# EAGLE design BoB Brain v01 (EAGLE 7.3.0)
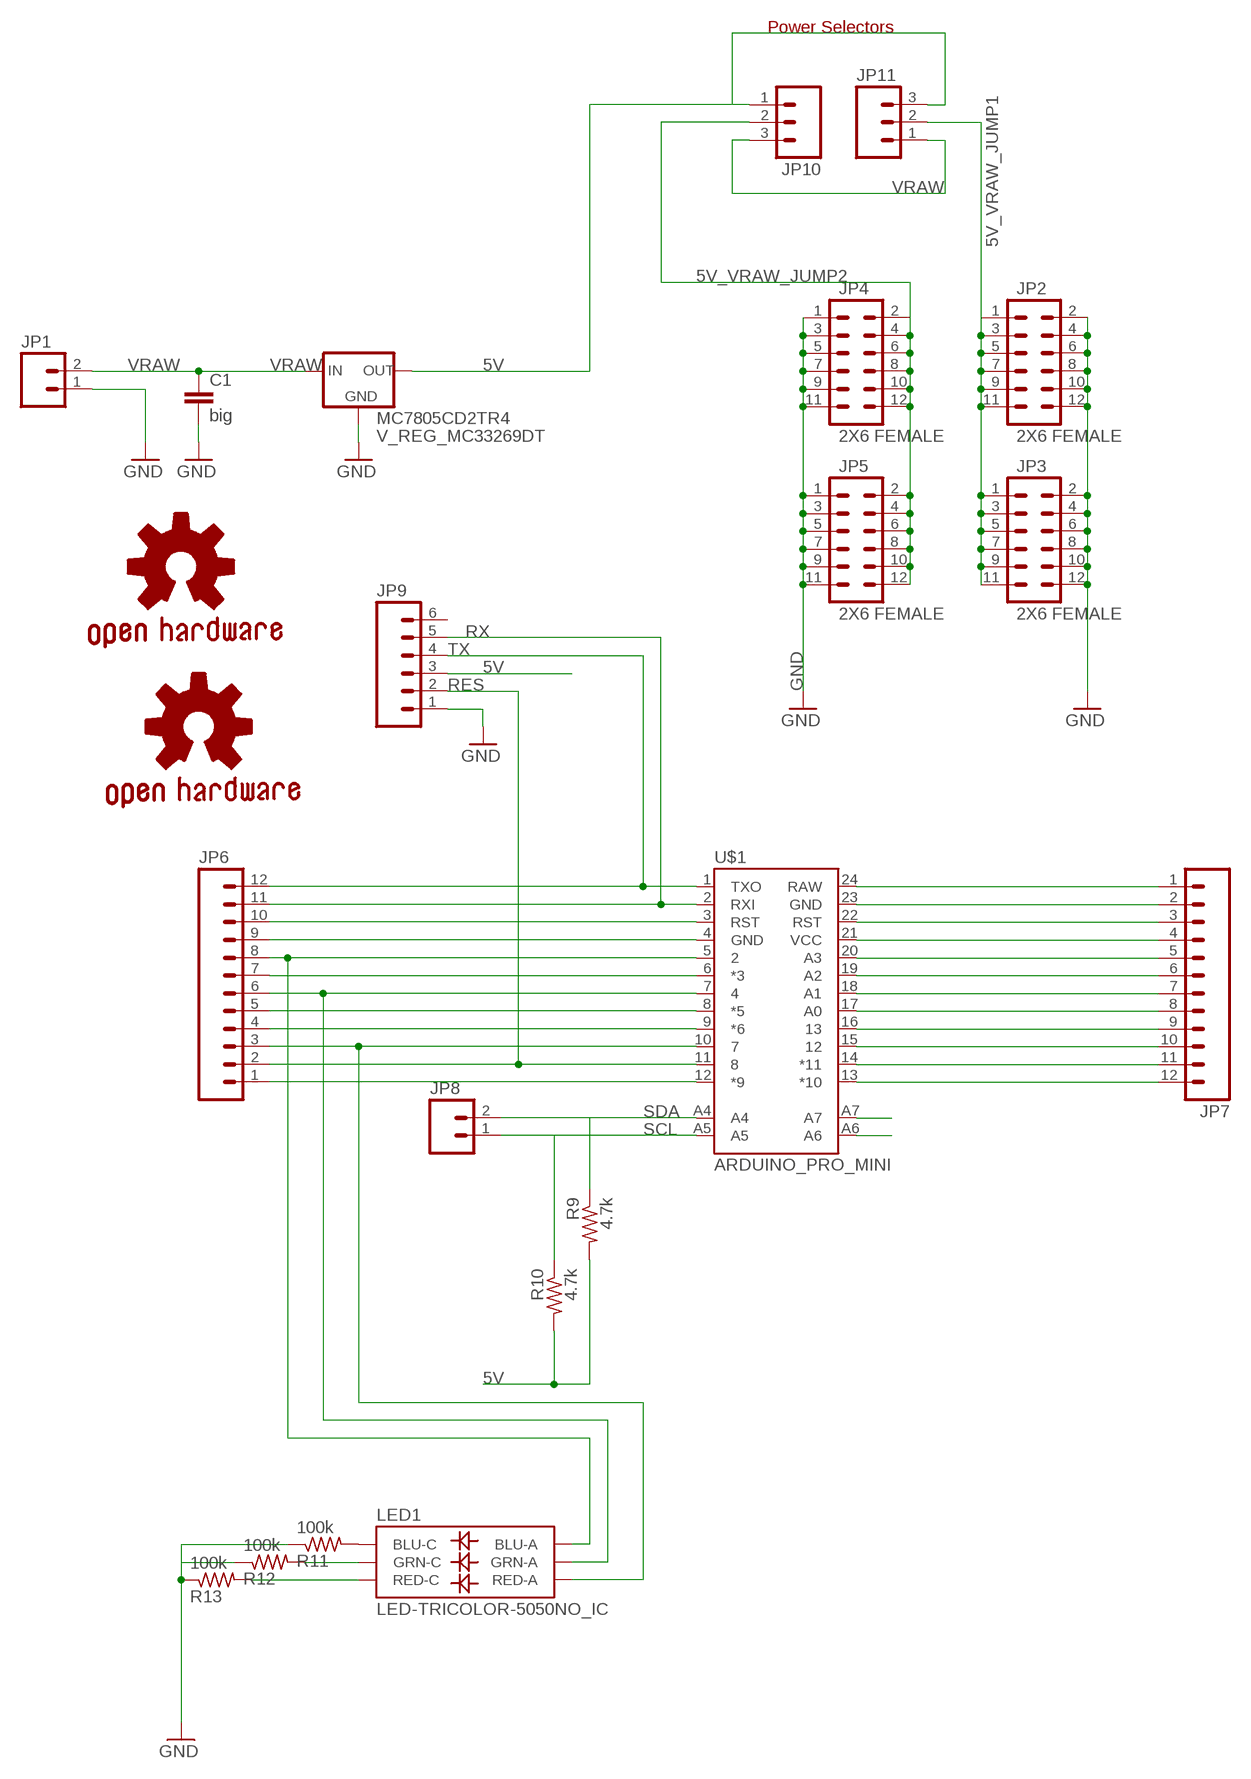
[diagram p0: schematic, sheet 1]

## Parts
C1  big  CAPPTH1  [CAP-PTH-5MM]
GOLD_ORB_SM1  OSHWLOGO_GOLD_ORB_MED  [OSHW1]
GOLD_ORB_SM2  OSHWLOGO_GOLD_ORB_SM  [OSHW2]
JP1  M025MM  [SCREWTERMINAL-5MM-2]
JP2  2X6 FEMALE  M06X2PTH_FEMALE  [2X6]
JP3  2X6 FEMALE  M06X2PTH_FEMALE  [2X6]
JP4  2X6 FEMALE  M06X2PTH_FEMALE  [2X6]
JP5  2X6 FEMALE  M06X2PTH_FEMALE  [2X6]
JP6  M12PTH  [1X12]
JP7  M12PTH  [1X12]
JP8  M02LOCK  [1X02_LOCK]
JP9  M06LOCK  [1X06_LOCK]
JP10  M03PTH  [1X03]
JP11  M03PTH  [1X03]
LED1  LED-TRICOLOR-5050NO_IC  [LED-TRICOLOR-5050]
MC7805CD2TR4  V_REG_MC33269DT  [DPAK]
R9  4.7k  R-US_M0805  [M0805]
R10  4.7k  R-US_M0805  [M0805]
R11  100k  R-US_R0805W  [R0805W]
R12  100k  R-US_R0805W  [R0805W]
R13  100k  R-US_R0805W  [R0805W]
U$1  ARDUINO_PRO_MINI  [ARDUINO_PRO_MINI]

## Nets
5V: JP9.3 JP10.1 JP11.3 MC7805CD2TR4.4(OUT) R9.2 R10.2
5V_VRAW_JUMP1: JP2.1 JP2.3 JP2.5 JP2.7 JP2.9 JP2.11 JP3.1 JP3.3 JP3.5 JP3.7 JP3.9 JP3.11 JP11.2
5V_VRAW_JUMP2: JP4.2 JP4.4 JP4.6 JP4.8 JP4.10 JP4.12 JP5.2 JP5.4 JP5.6 JP5.8 JP5.10 JP5.12 JP10.2
APM_PIN_3: JP6.7 U$1.6(*3)
APM_PIN_5: JP6.5 U$1.8(*5)
APM_PIN_6: JP6.4 U$1.9(*6)
APM_PIN_9: JP6.1 U$1.12(*9)
GND: C1.2 JP1.1 JP2.2 JP2.4 JP2.6 JP2.8 JP2.10 JP2.12 JP3.2 JP3.4 JP3.6 JP3.8 JP3.10 JP3.12 JP4.1 JP4.3 JP4.5 JP4.7 JP4.9 JP4.11 JP5.1 JP5.3 JP5.5 JP5.7 JP5.9 JP5.11 JP9.1 MC7805CD2TR4.1(GND) R11.1 R12.1 R13.1
N$3: JP6.10 U$1.3(RST)
N$4: JP6.9 U$1.4(GND)
N$5: JP6.8 LED1.3(BLU-A) U$1.5
N$6: LED1.4(BLU-C) R11.2
N$7: JP6.6 LED1.1(GRN-A) U$1.7
N$8: LED1.6(GRN-C) R12.2
N$9: LED1.5(RED-C) R13.2
N$10: JP6.3 LED1.2(RED-A) U$1.10
N$15: JP7.1 U$1.24(RAW)
N$16: JP7.2 U$1.23(GND)
N$17: JP7.3 U$1.22(RST)
N$18: JP7.4 U$1.21(VCC)
N$19: JP7.5 U$1.20(A3)
N$20: JP7.6 U$1.19(A2)
N$21: JP7.7 U$1.18(A1)
N$22: JP7.8 U$1.17(A0)
N$23: JP7.9 U$1.16
N$24: JP7.10 U$1.15
N$25: JP7.11 U$1.14(*11)
N$26: JP7.12 U$1.13(*10)
N$27: U$1.A7
N$28: U$1.A6
RES: JP6.2 JP9.2 U$1.11
RX: JP6.11 JP9.5 U$1.2(RXI)
SCL: JP8.1 R10.1 U$1.A5
SDA: JP8.2 R9.1 U$1.A4
TX: JP6.12 JP9.4 U$1.1(TXO)
VRAW: C1.1 JP1.2 JP10.3 JP11.1 MC7805CD2TR4.3(IN)
Unconnected: JP9.6

## Notes on the sheet
- Power Selectors

## Library data of the parts
C1 = SparkFun-Passives:CAP: Capacitor Standard 0603 ceramic capacitor, and 0.1" leaded capacitor.
GOLD_ORB_SM1 GOLD_ORB_SM2 = bfl:OSHWLOGO: These are Open-Source Hardware logos.
JP1 = SparkFun-Connectors:M02: Standard 2-pin 0.1" header. Use with - straight break away headers ( PRT-00116) - right angle break away headers (PRT-00553) - swiss pins (PRT-00743) - machine pins (PRT-00117) - female headers (PRT-00115) Molex polarized connector foot print use with: PRT-08233 with associated crimp pins and housings. 2.54_SCREWTERM for use with PRT-10571. 3.5mm Screw Terminal footprints for PRT-08084 5mm Screw Terminal footprints for use with PRT-08432; STOREFRONT_ID: PRT-08432
JP2-JP5 = SparkFun-Connectors:M06X2; PROD_ID: CONN-12423
JP6 JP7 = SparkFun-Connectors:M12: Header 12 Standard 12-pin 0.1" header. Use with straight break away headers (SKU : PRT-00116), right angle break away headers (PRT-00553), swiss pins (PRT-00743), machine pins (PRT-00117), and female headers (PRT-00115).
JP8 = SparkFun-Connectors:M02: Standard 2-pin 0.1" header. Use with - straight break away headers ( PRT-00116) - right angle break away headers (PRT-00553) - swiss pins (PRT-00743) - machine pins (PRT-00117) - female headers (PRT-00115) Molex polarized connector foot print use with: PRT-08233 with associated crimp pins and housings. 2.54_SCREWTERM for use with PRT-10571. 3.5mm Screw Terminal footprints for PRT-08084 5mm Screw Terminal footprints for use with PRT-08432
JP9 = SparkFun-Connectors:M06: Header 6 Standard 6-pin 0.1" header. Use with straight break away headers (SKU : PRT-00116), right angle break away headers (PRT-00553), swiss pins (PRT-00743), machine pins (PRT-00117), and female headers (PRT-00115). Molex polarized connector foot print use with SKU : PRT-08094 with associated crimp pins and housings. NOTES ON THE VARIANTS LOCK and LOCK_LONGPADS... This footprint was designed to help hold the alignment of a through-hole component (i.e. 6-pin header) while soldering it into place. You may notice that each hole has been shifted either up or down by 0.005 of an inch from it's more standard position (which is a perfectly straight line). This slight alteration caused the pins (the squares in the middle) to touch the edges of the holes. Because they are alternating, it causes a "brace" to hold the component in place. 0.005 has proven to be the perfect amount of "off-center" position when using our standard breakaway headers. Although looks a little odd when you look at the bare footprint, once you have a header in there, the alteration is very hard to notice. Also,if you push a header all the way into place, it is covered up entirely on the bottom side. This idea of altering the position of holes to aid alignment will be further integrated into the Sparkfun Library for other footprints. It can help hold any component with 3 or more connection pins.
JP10 JP11 = SparkFun-Connectors:M03: Header 3 Standard 3-pin 0.1" header. Use with straight break away headers (SKU : PRT-00116), right angle break away headers (PRT-00553), swiss pins (PRT-00743), machine pins (PRT-00117), and female headers (PRT-00115). Molex polarized connector foot print use with SKU : PRT-08232 with associated crimp pins and housings.
LED1 = SparkFun-LED:LED-TRICOLOR-5050
MC7805CD2TR4 = SparkFun-PowerIC:V_REG_MC33269
R9-R13 = resistor:R-US_: RESISTOR, American symbol
U$1 = SparkFun-Boards:ARDUINO_PRO_MINI

## Board
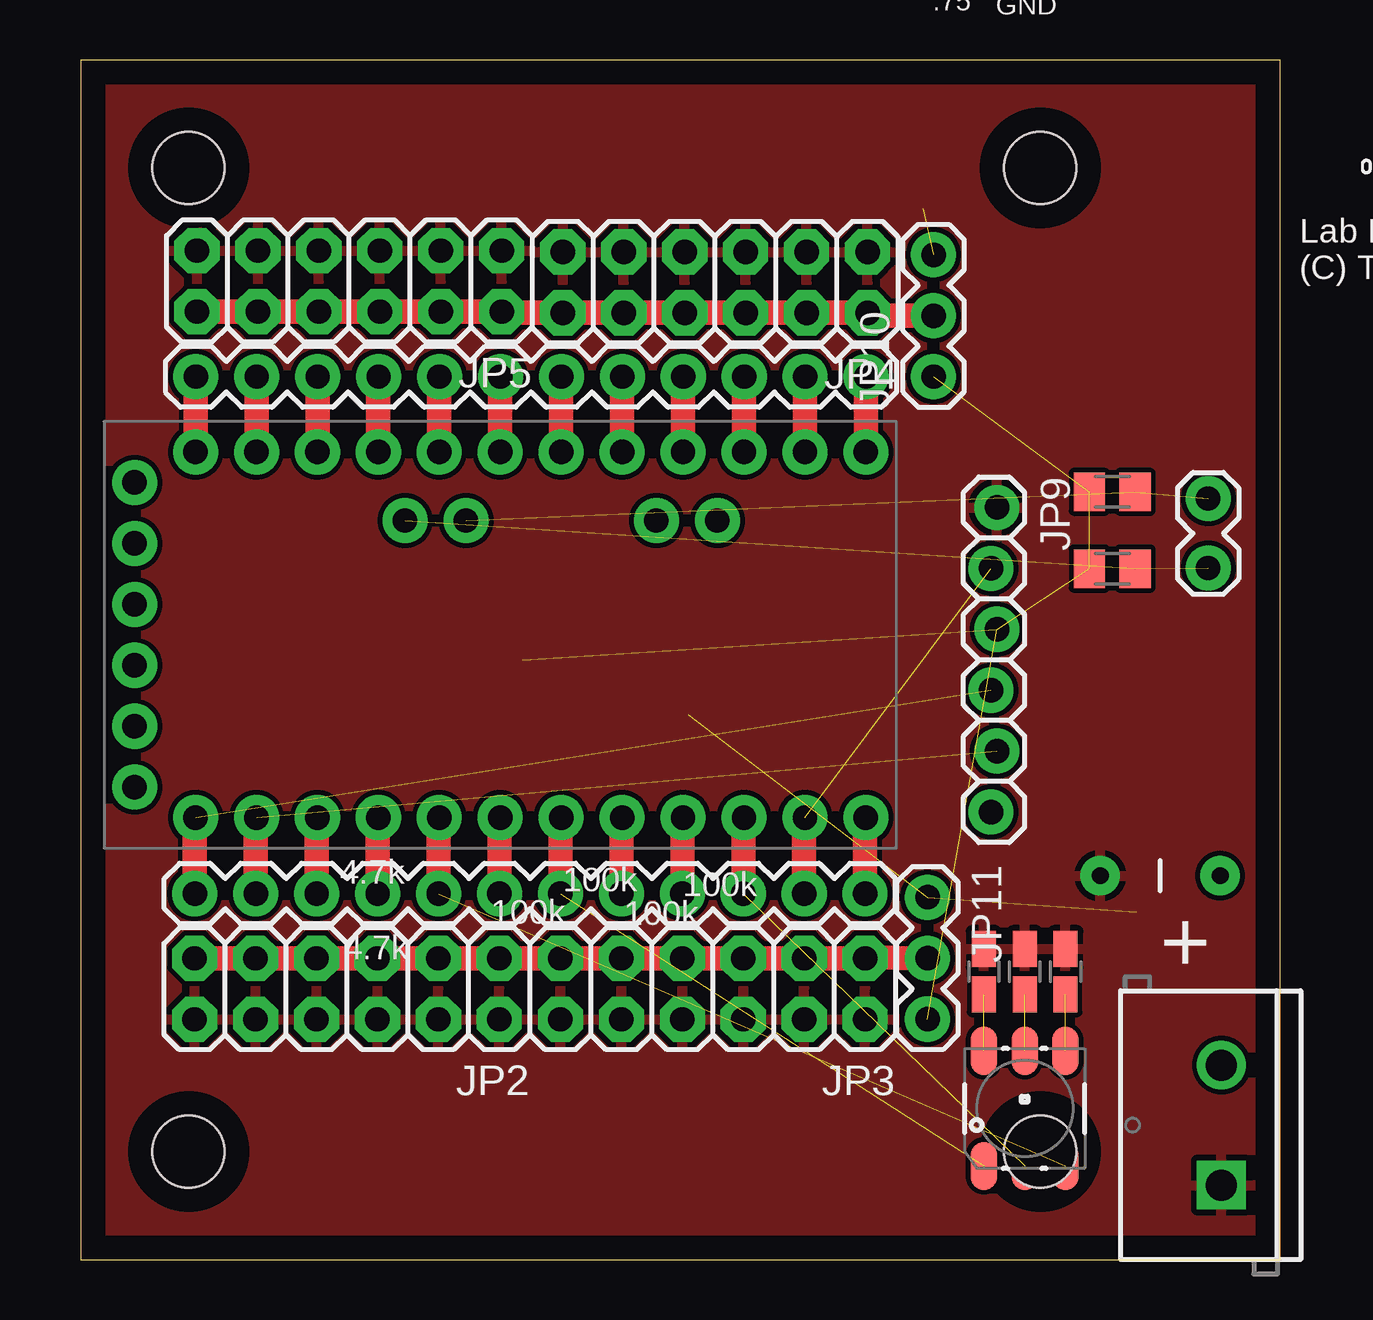
[diagram p1: board, top side]
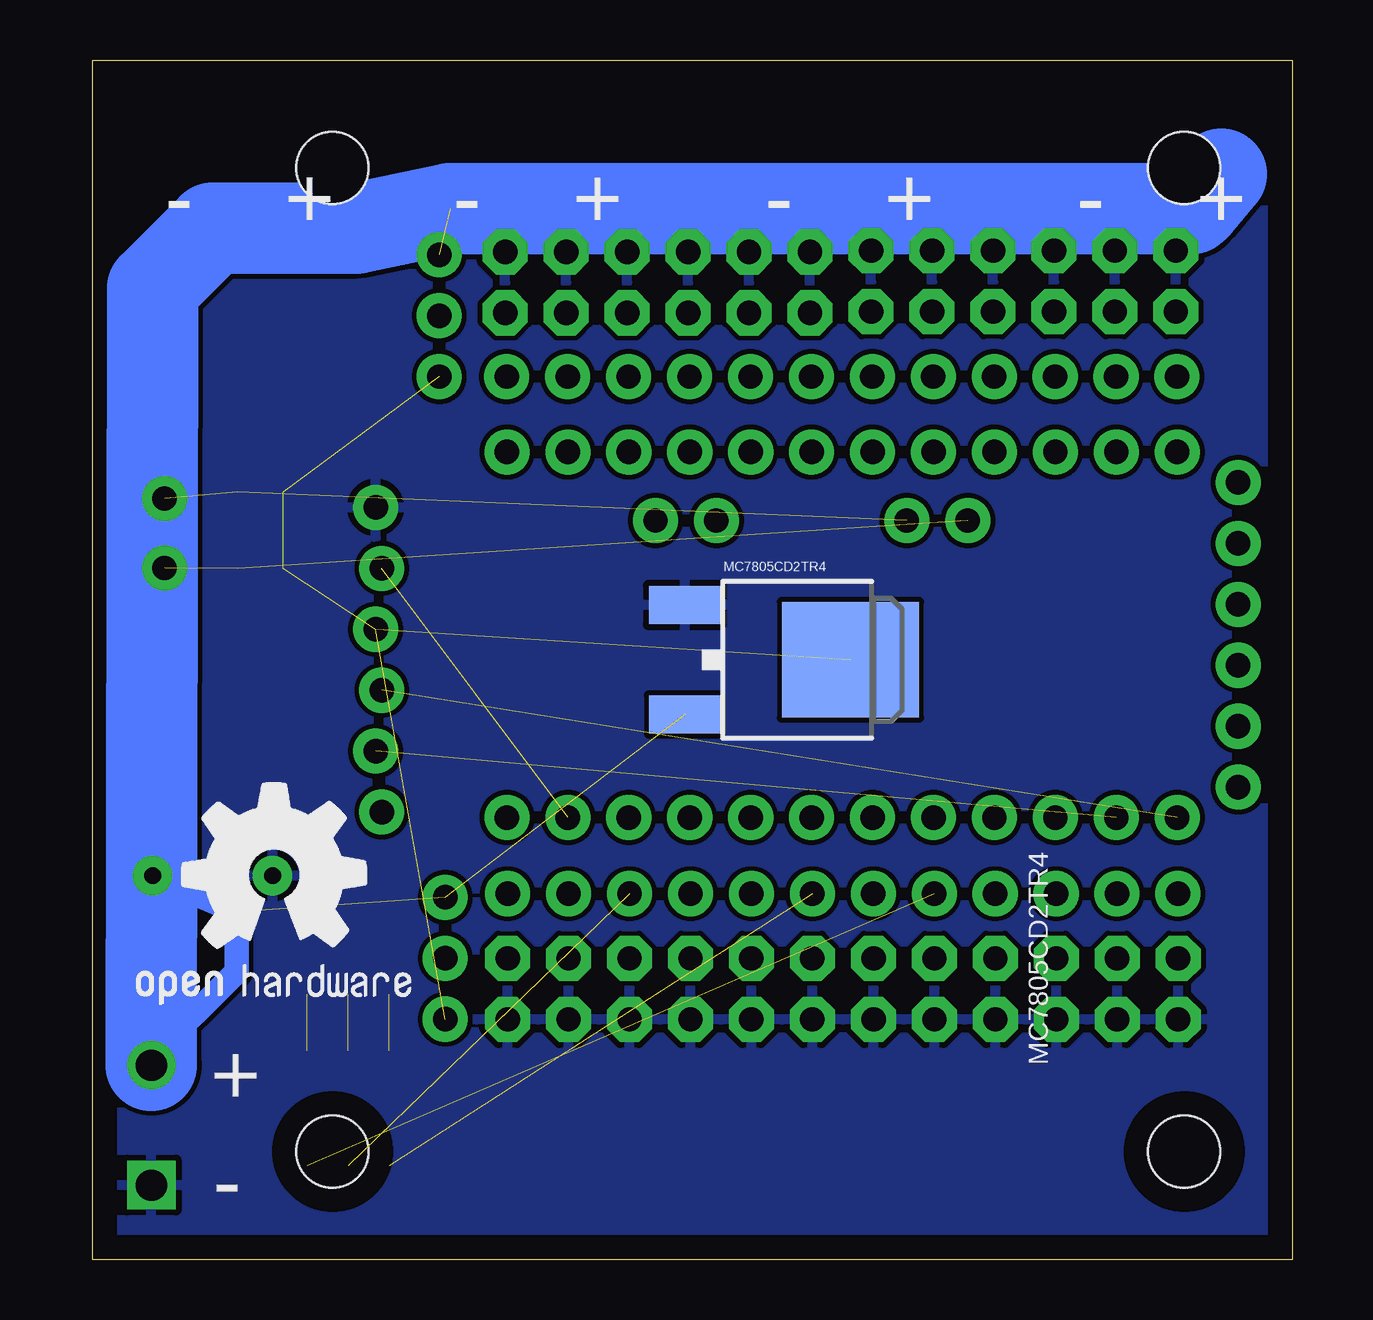
[diagram p2: board, bottom side, seen from below]

Size 50 x 50 mm. Coordinates in mm from the lower left corner, seen from the top.
Outline: 0,0 50,0 50,50 0,50 0,0
Copper layers (1*16): Top 0.035mm / dielectric 1.5mm / Bottom 0.035mm
Design rules "default": minimum track width 10mil, minimum drill 24mil, track to track 8mil, track to pad 8mil, pad to pad 8mil, via to via 8mil, smd to smd 8mil, copper to edge 40mil, drill to drill 8mil, minimum pad ring 10mil, minimum via ring 8mil, stop-mask expansion 4mil, vias tented up to drill 0mil, thermal gap 10mil
Holes 3 mm at 4.5,45.5 40,45.5 4.5,4.5 40,4.5

### Footprints (pad centres in the part's own frame; a part is rotated, then mirrored left to right if it is on the bottom)
CAP-PTH-5MM = drill 0.7 pad 1.651: 1 -2.5,0; 2 2.5,0
SCREWTERMINAL-5MM-2 = drill 1.3 pad 2.032 square: 1 0,0 | drill 1.3 pad 2.032: 2 5,0
2X6 = drill 1.016 pad 1.88 octagon: 1 0,0; 2 0,2.54; 3 2.54,0; 4 2.54,2.54; 5 5.08,0; 6 5.08,2.54; 7 7.62,0; 8 7.62,2.54; 9 10.16,0; 10 10.16,2.54; 11 12.7,0; 12 12.7,2.54
1X12 = drill 1.016 pad 1.88: 1 0,0; 2 2.54,0; 3 5.08,0; 4 7.62,0; 5 10.16,0; 6 12.7,0; 7 15.24,0; 8 17.78,0; 9 20.32,0; 10 22.86,0; 11 25.4,0; 12 27.94,0
1X02_LOCK = drill 1.016 pad 1.88: 1 -0.178,0; 2 2.718,0
1X06_LOCK = drill 1.016 pad 1.88: 1 0,0; 2 2.54,-0.254; 3 5.08,0; 4 7.62,-0.254; 5 10.16,0; 6 12.7,-0.254
1X03 = drill 1.016 pad 1.88: 1 0,0; 2 2.54,0; 3 5.08,0
LED-TRICOLOR-5050 = smd 2 x 1.1: 1 -2.4,1.7; 2 -2.4,0; 3 -2.4,-1.7; 4 2.4,-1.7; 5 2.4,0; 6 2.4,1.7
DPAK = smd 1.6 x 3: 1 -2.28,-5.31; 3 2.28,-5.31 | smd 4.826 x 5.715: 4 0,1.588
M0805 = smd 1.3 x 1.6: 1 -0.95,0; 2 0.95,0
R0805W = smd 1.5 x 1: 1 -0.94,0; 2 0.94,0
ARDUINO_PRO_MINI = drill 1.016 pad 1.88: 1 -7.62,12.7; 2 -7.62,10.16; 3 -7.62,7.62; 4 -7.62,5.08; 5 -7.62,2.54; 6 -7.62,0; 7 -7.62,-2.54; 8 -7.62,-5.08; 9 -7.62,-7.62; 10 -7.62,-10.16; 11 -7.62,-12.7; 12 -7.62,-15.24; 13 7.62,-15.24; 14 7.62,-12.7; 15 7.62,-10.16; 16 7.62,-7.62; 17 7.62,-5.08; 18 7.62,-2.54; 19 7.62,0; 20 7.62,2.54; 21 7.62,5.08; 22 7.62,7.62; 23 7.62,10.16; 24 7.62,12.7; A4 4.763,1.429; A5 4.763,3.969; A6 4.763,-9.049; A7 4.763,-6.509; BLK -6.35,15.24; GND -3.81,15.24; GRN 6.35,15.24; RXI 1.27,15.24; TXO 3.81,15.24; VCC -1.27,15.24

### Placement (x,y rotation side)
C1  45,16 180 top
GOLD_ORB_SM1  48.8,8.9 0 bottom
GOLD_ORB_SM2  53,44 0 top
JP1  47.55,3.1 90 top
JP2  17.45,12.55 180 top
JP3  32.7,12.55 180 top
JP4  32.8,42 180 top
JP5  17.55,42.05 180 top
JP6  32.7,15.25 180 top
JP7  4.8,36.8 0 top
JP8  47,29 90 top
JP9  38.2,31.35 270 top
JP10  35.55,36.8 90 top
JP11  35.3,15.1 270 top
LED1  39.35,6.3 90 top
MC7805CD2TR4  20,25 270 bottom
R9  43,32 180 top
R10  43,28.8 180 top
R11  41.05,12 270 top
R12  37.65,12 270 top
R13  39.35,12 270 top
U$1  17.49,26.04 90 top

### Tracks (layer width: path | path; a pad name or v marks a point on that pad's centre or on a via)
5V  (5 unrouted)
5V_VRAW_JUMP1
  Top 1.016: JP11.2 32.7,12.59 JP3.1 JP3.3 JP3.5 JP3.7 JP3.9 JP3.11 JP2.1 JP2.3 JP2.5 JP2.7 JP2.9 JP2.11
5V_VRAW_JUMP2
  Top 1.016: JP10.2 32.8,39.34 JP4.2 JP4.4 JP4.6 JP4.8 JP4.10 JP4.12 17.55,39.46 JP5.2 JP5.4 JP5.6 JP5.8 JP5.10 JP5.12
APM_PIN_3
  Top 1.016: U$1.6 17.46,18.42 JP6.7
APM_PIN_5
  Top 1.016: U$1.8 22.54,18.42 JP6.5
APM_PIN_6
  Top 1.016: U$1.9 25.08,18.42 JP6.4
APM_PIN_9
  Top 1.016: U$1.12 32.7,18.42 JP6.1
GND
  pour Bottom: -1,51 51,51 51,-2 -1,-2
  pour Top: -1,51 51,51 51,-2 -1,-2
N$3
  Top 1.016: U$1.3 9.84,18.42 JP6.10
N$4
  Top 1.016: U$1.4 12.38,18.42 JP6.9
N$5  (1 unrouted)
  Top 1.016: U$1.5 14.92,18.42 JP6.8
N$6  (1 unrouted)
N$7  (1 unrouted)
  Top 1.016: U$1.7 20,18.42 JP6.6
N$8  (1 unrouted)
N$9  (1 unrouted)
N$10  (1 unrouted)
  Top 1.016: U$1.10 27.62,18.42 JP6.3
N$15
  Top 1.016: JP7.1 U$1.24
N$16
  Top 1.016: JP7.2 U$1.23
N$17
  Top 1.016: JP7.3 U$1.22
N$18
  Top 1.016: JP7.4 U$1.21
N$19
  Top 1.016: JP7.5 U$1.20
N$20
  Top 1.016: JP7.6 U$1.19
N$21
  Top 1.016: JP7.7 U$1.18
N$22
  Top 1.016: JP7.8 U$1.17
N$23
  Top 1.016: JP7.9 U$1.16
N$24
  Top 1.016: JP7.10 U$1.15
N$25
  Top 1.016: JP7.11 U$1.14
N$26
  Top 1.016: JP7.12 U$1.13
RES  (1 unrouted)
  Top 1.016: U$1.11 30.16,18.42 JP6.2
RX  (1 unrouted)
  Top 1.016: U$1.2 7.3,18.42 JP6.11
SCL  (2 unrouted)
SDA  (2 unrouted)
TX  (1 unrouted)
  Top 1.016: U$1.1 4.76,18.42 JP6.12
VRAW  (3 unrouted)
  Bottom 0.406: JP1.2 47.55,8.45
  Bottom 1.016: 47.55,8.45 44,12 44,14.5 C1.1
  Bottom 3.81: JP1.2 47.5,39.95 47.5,40.5 45,43 39,43 35.1,43.8 4.2,43.8 4,44 2.95,45.25

### Text on the board
tNames: Lab LED Controller v01 / (C) Thomas Brittain | 4.7k | 100k | 100k | 100k | 100k | 4.7k | +
bNames: + | - | + | - | + | - | + | - | MC7805CD2TR4 | + | -
_tsilk: GND | .75